# Altium schematic sheet Лист1.SchDoc: STM32_shield
size 594 x 420 mm; Author: Тихонов; DrawnBy: Тихонов
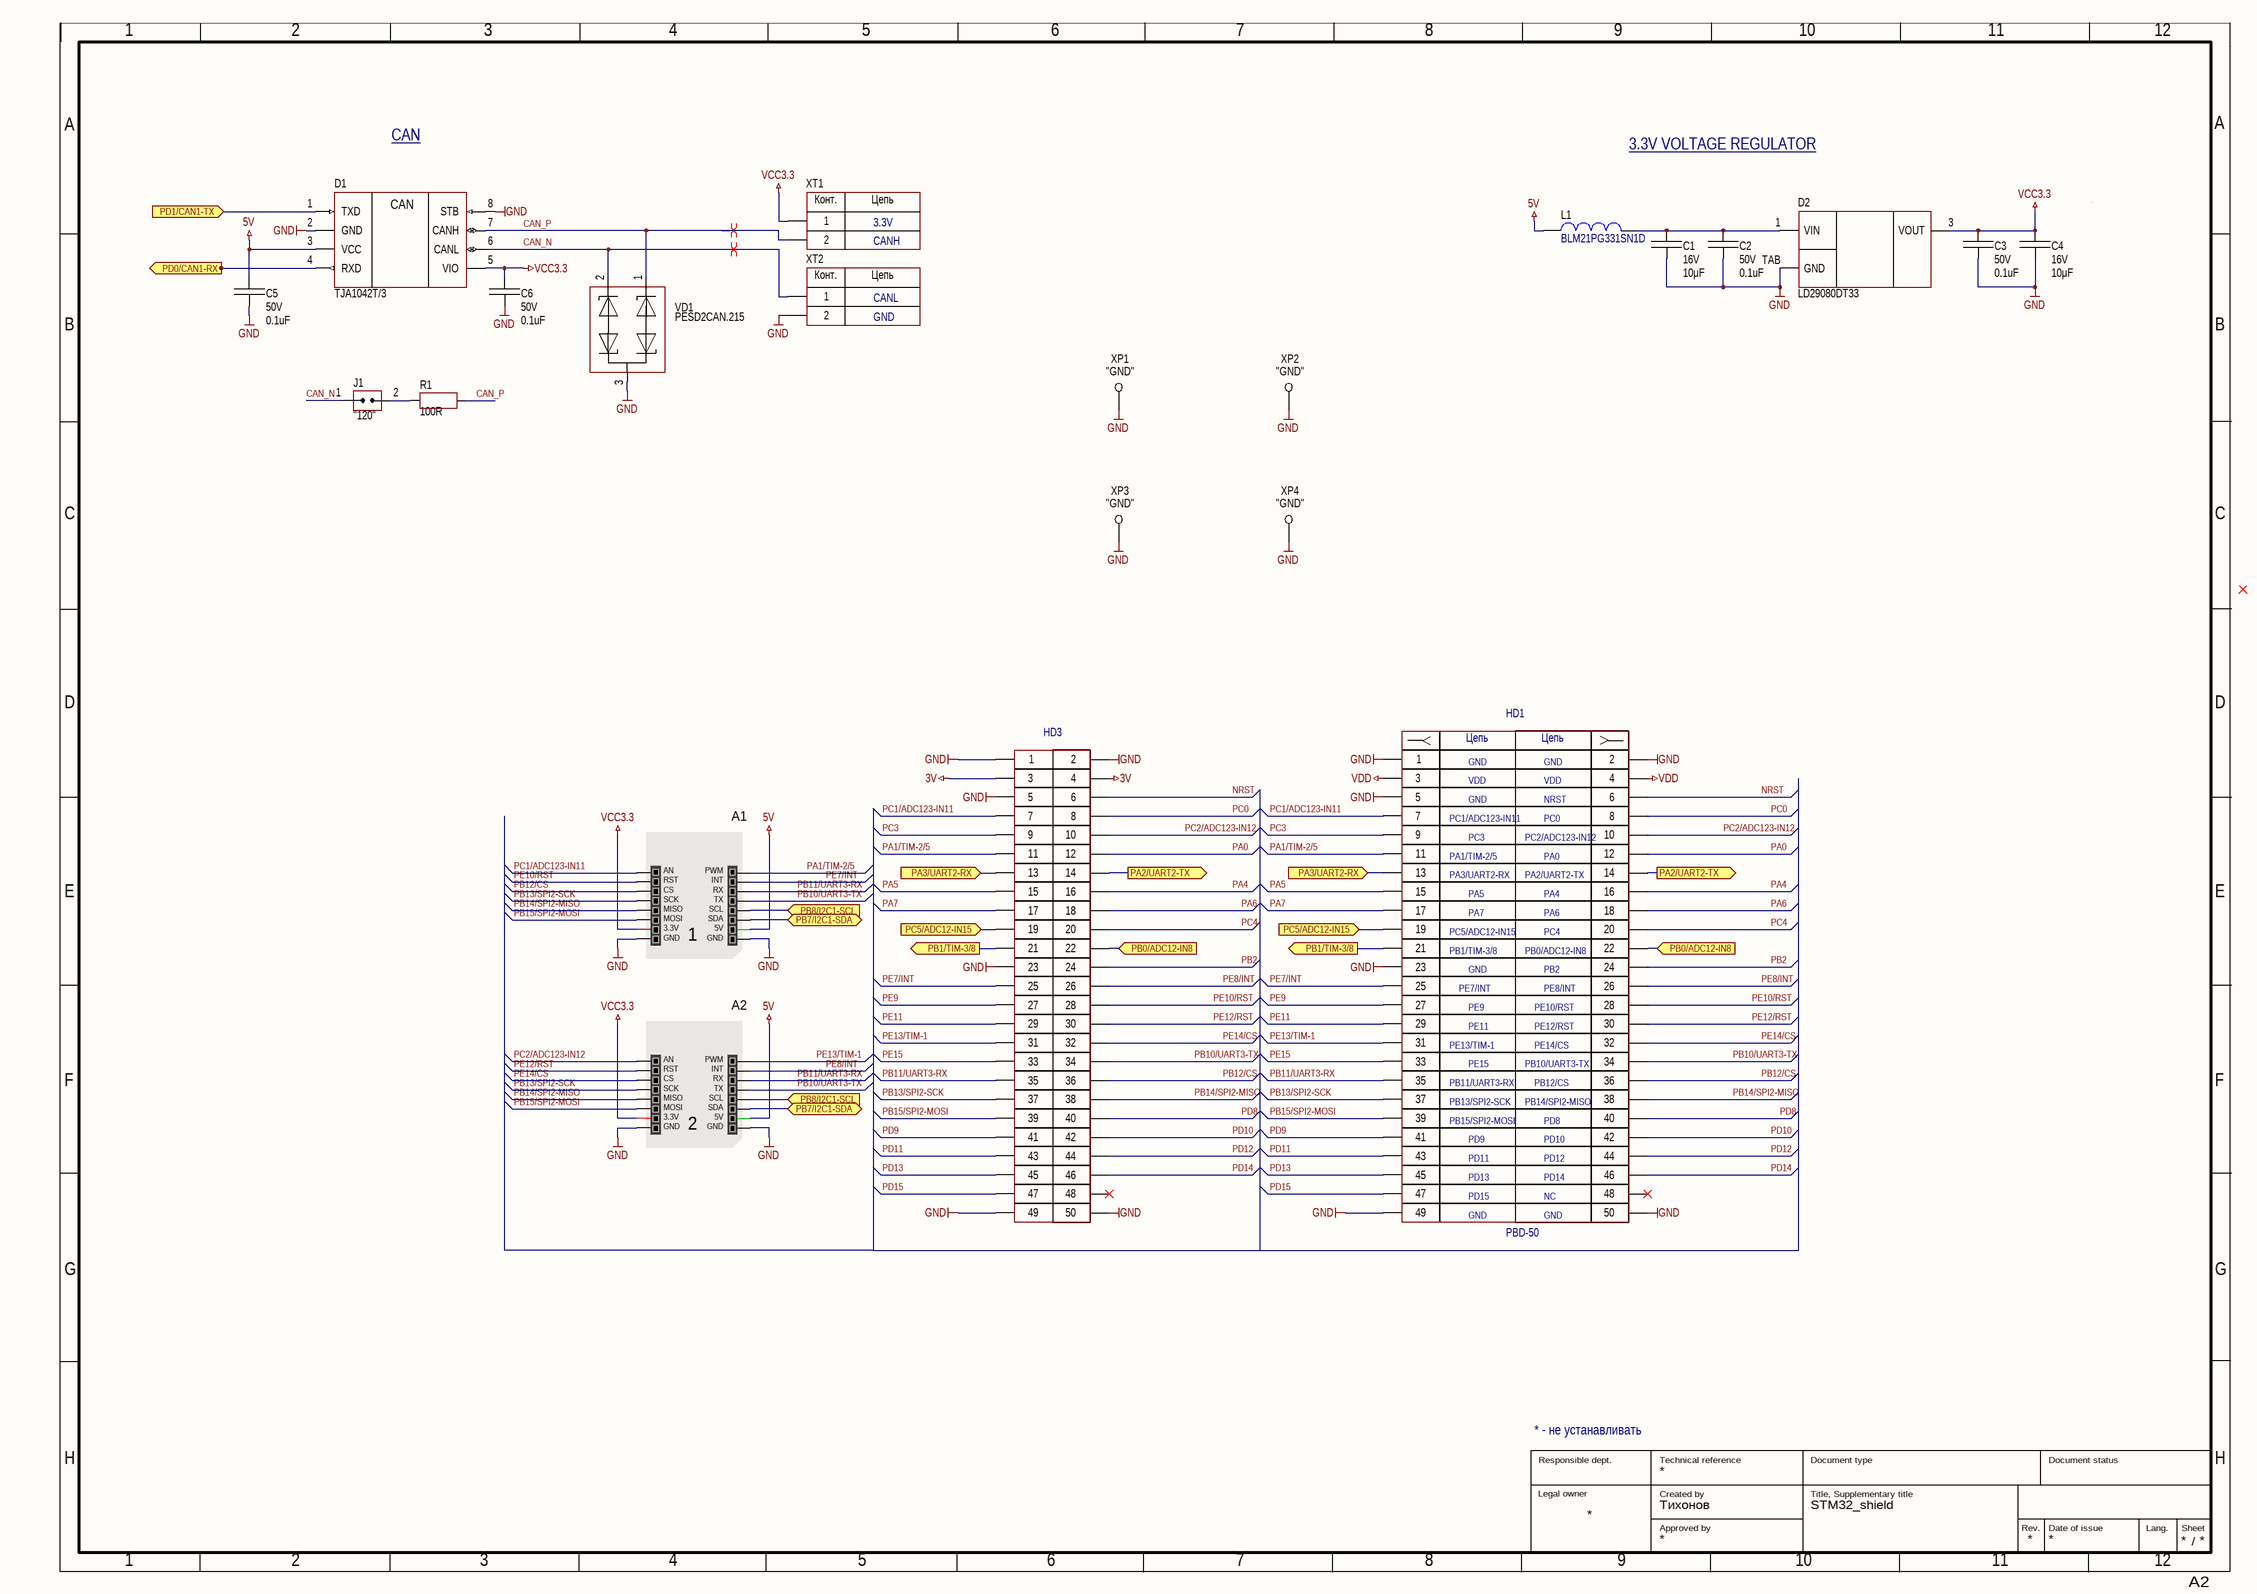
[diagram p0: Лист1.SchDoc]

## Parts
A1  MIKROBUS HOST CONN._1  [MIKROBUS HOST CONN.]  (value not drawn)
A2  MIKROBUS HOST CONN._1  [MIKROBUS HOST CONN.]  (value not drawn)
C1  value 10μF  Voltage: 16V  [CAP: TANTAL-A]
C2  value 0.1uF  Voltage: 50V  [CAP: 0603]
C3  value 0.1uF  Voltage: 50V  [CAP: 0603]
C4  value 10μF  Voltage: 16V  [CAP: TANTAL-A]
C5  value 0.1uF  Voltage: 50V  [CAP: 0603]
C6  value 0.1uF  Voltage: 50V  [CAP: 0603]
D1  (no value)  [8-SOIC]
D2  PartNumber: LD29080DT33  [DPAK(LDO)]
HD1  PBD-50  [CON: PBD-50]
HD3  PBD-50-1  [CON: PBD-50_NOT3D]  (value not drawn)
J1  CommentText: "120"  [CON: PLS-2]  (hidden comment: PLS-2)
L1  BLM21PG331SN1D  [IND: 0805]
R1  value 100R  [RES: 0603]
VD1  PartNumber: PESD2CAN.215  [SOT23]
XP1  "GND"  [CON: PLS-1]
XP2  "GND"  [CON: PLS-1]
XP3  "GND"  [CON: PLS-1]
XP4  "GND"  [CON: PLS-1]
XT1  (no value)  [CON: MPT 0,5/ 2-2,54 (Phoenix)]
XT2  (no value)  [CON: MPT 0,5/ 2-2,54 (Phoenix)]

## Ports
PA2/UART2-TX (out), PA3/UART2-RX (in), PB0/ADC12-IN8 (in), PB1/TIM-3/8 (out), PB7/I2C1-SDA (bidir), PB8/I2C1-SCL (in), PC5/ADC12-IN15 (in), PD0/CAN1-RX (out), PD1/CAN1-TX (in)

## Nets
3V: HD3.3 HD3.4
5V: A1.10(5V) A2.10(5V) C5.2 D1.3(VCC) L1.2
GND: A1.8(GND) A1.9(GND) A2.8(GND) A2.9(GND) C1.1 C2.1 C3.1 C4.1 C5.1 C6.1 D1.2(GND) D1.8(STB) D2.TAB(GND) HD1.1 HD1.2 HD1.5 HD1.23 HD1.49 HD1.50 HD3.1 HD3.2 HD3.5 HD3.23 HD3.49 HD3.50 VD1.3 XP1.1 XP2.1 XP3.1 XP4.1 XT2.2
VCC3.3: A1.7(3.3V) A2.7(3.3V) C3.2 C4.2 C6.2 D1.5(VIO) D2.3(VOUT) XT1.1
VDD: HD1.3 HD1.4
CAN_N: D1.6(CANL) J1.1(IN) VD1.2 XT2.1
CAN_P: D1.7(CANH) R1.2 VD1.1 XT1.2
NRST: HD1.6 HD3.6
PA0: HD1.12 HD3.12
PA1/TIM-2/5: A1.16(PWM) HD1.11 HD3.11
PA2/UART2-TX: HD1.14 HD3.14 ; port PA2/UART2-TX
PA3/UART2-RX: HD1.13 HD3.13 ; port PA3/UART2-RX
PA4: HD1.16 HD3.16
PA5: HD1.15 HD3.15
PA6: HD1.18 HD3.18
PA7: HD1.17 HD3.17
PB0/ADC12-IN8: HD1.22 HD3.22 ; port PB0/ADC12-IN8
PB1/TIM-3/8: HD1.21 HD3.21 ; port PB1/TIM-3/8
PB2: HD1.24 HD3.24
PB7/I2C1-SDA: A1.11(SDA) A2.11(SDA) ; port PB7/I2C1-SDA
PB8/I2C1-SCL: A1.12(SCL) A2.12(SCL) ; port PB8/I2C1-SCL
PB10/UART3-TX: A1.13(TX) A2.13(TX) HD1.34 HD3.34
PB11/UART3-RX: A1.14(RX) A2.14(RX) HD1.35 HD3.35
PB12/CS: A1.3(CS) HD1.36 HD3.36
PB13/SPI2-SCK: A1.4(SCK) A2.4(SCK) HD1.37 HD3.37
PB14/SPI2-MISO: A1.5(MISO) A2.5(MISO) HD1.38 HD3.38
PB15/SPI2-MOSI: A1.6(MOSI) A2.6(MOSI) HD1.39 HD3.39
PC0: HD1.8 HD3.8
PC1/ADC123-IN11: A1.1(AN) HD1.7 HD3.7
PC2/ADC123-IN12: A2.1(AN) HD1.10 HD3.10
PC3: HD1.9 HD3.9
PC4: HD1.20 HD3.20
PC5/ADC12-IN15: HD1.19 HD3.19 ; port PC5/ADC12-IN15
PD0/CAN1-RX: D1.4(RXD) ; port PD0/CAN1-RX
PD1/CAN1-TX: D1.1(TXD) ; port PD1/CAN1-TX
PD8: HD1.40 HD3.40
PD9: HD1.41 HD3.41
PD10: HD1.42 HD3.42
PD11: HD1.43 HD3.43
PD12: HD1.44 HD3.44
PD13: HD1.45 HD3.45
PD14: HD1.46 HD3.46
PD15: HD1.47 HD3.47
PE7/INT: A1.15(INT) HD1.25 HD3.25
PE8/INT: A2.15(INT) HD1.26 HD3.26
PE9: HD1.27 HD3.27
PE10/RST: A1.2(RST) HD1.28 HD3.28
PE11: HD1.29 HD3.29
PE12/RST: A2.2(RST) HD1.30 HD3.30
PE13/TIM-1: A2.16(PWM) HD1.31 HD3.31
PE14/CS: A2.3(CS) HD1.32 HD3.32
PE15: HD1.33 HD3.33
NetC1_2: C1.2 C2.2 D2.1(VIN) L1.1
NetJ1_2: J1.2(IN) R1.1

Not connected (* = marked no-connect by the designer): HD1 48*; HD3 48*

## Layout directives
differential pair: CAN_N, CAN_P

## Notes on the sheet
- CAN
- 3.3V VOLTAGE REGULATOR
- 3.3V
- CANH
- CANL
- GND
- (near HD1) GND
- (near HD1) VDD
- (near HD1) PC1/ADC123-IN11
- (near HD1) PC3
- (near HD1) PC2/ADC123-IN12
- (near HD1) NRST
- (near HD1) PC0
- (near HD1) PA1/TIM-2/5
- (near HD1) PA3/UART2-RX
- (near HD1) PA2/UART2-TX
- (near HD1) PA0
- (near HD1) PC5/ADC12-IN15
- (near HD1) PA5
- (near HD1) PA7
- (near HD1) PA4
- (near HD1) PA6
- (near HD1) PC4
- (near A1) 1
- (near HD1) PB1/TIM-3/8
- (near HD1) PB0/ADC12-IN8
- (near HD1) PB2
- (near HD1) PE7/INT
- (near HD1) PE9
- (near HD1) PE11
- (near HD1) PE10/RST
- (near HD1) PE12/RST
- (near HD1) PE8/INT
- (near HD1) PE13/TIM-1
- (near HD1) PE15
- (near HD1) PB10/UART3-TX
- (near HD1) PE14/CS
- (near HD1) PB11/UART3-RX
- (near HD1) PB13/SPI2-SCK
- (near HD1) PB15/SPI2-MOSI
- (near HD1) PB14/SPI2-MISO
- (near HD1) PB12/CS
- (near HD1) PD8
- (near A2) 2
- (near HD1) PD9
- (near HD1) PD11
- (near HD1) PD10
- (near HD1) PD12
- (near HD1) PD13
- (near HD1) PD15
- (near HD1) PD14
- (near HD1) NC
- * - не устанавливать
- 3
- 4
- 5
- 6
- 7
- 8
- 9
- 10
- 11
- 12
- A
- B
- C
- D
- E
- F
- G
- H
- Responsible dept.
- Technical reference
- Document type
- Document status
- Legal owner
- Created by
- Title, Supplementary title
- Approved by
- Rev.
- Date of issue
- Lang.
- Sheet
- /
- A2
- (in symbol Connector_terminal_2pin) Конт.; Цепь
- (in symbol PBD-50) Цепь

## Library data of the parts
A1 = MIKROBUS HOST CONN._1: mikroBUS Host Socket; PartNumber: PBS-8 (2pcs); Manufacturer: Connfly; Number: 1; SMD: No; HelpURL: https://www.electronshik.ru/item/CONNFLY/PBS-8
A2 = MIKROBUS HOST CONN._1: mikroBUS Host Socket; PartNumber: PBS-8 (2pcs); Manufacturer: Connfly; Number: 2; SMD: No; HelpURL: https://www.electronshik.ru/item/CONNFLY/PBS-8
C1 C4 = Tantal_B: Manufacturer: AVX; PartNumber: TAJB106K016RNJ; ValueManufacturerPartNumber: Tantalum capacitor, 10μF, 16V, ±10%, 1.2Ohm, case B (3528), -55...+125°C; Impedance: 1.2Ohm; Tolerance: ±10%; TypeDielectric: X7R; TypeCapacitor: Tantalum capacitor; Package: case B (3528); HelpURL: https://www.electronshik.ru/item/AVX/TAJB106K016RNJ; Temperature: -55...+125°C
C2 C3 C5 C6 = Ceramic_0603: Manufacturer: SAMSUNG; PartNumber: CL10B104KB8NNNC; ValueManufacturerPartNumber: Ceramic capacitor, 0.1uF, X7R, ±10%, 50V, 0603, -55...+125°C; TypeCapacitor: Ceramic capacitor; Tolerance: ±10%; TypeDielectric: X7R; Package: 0603; HelpURL: https://www.electronshik.ru/item/SAMSUNG/CL10B104KB8NNNC; Temperature: -55...+125°C
D1 = TJA1042T/3: CAN; Manufacturer: NXP; Supply: 5V; DataRate: 5Mbps; HelpURL: https://www.electronshik.ru/item/NXP/TJA1042T%3A%3A3.118; Package: SO8; ComponentType: IC CAN transceiver; ValueManufacturerPartNumber: =ComponentType+', '+DataRate+', '+TypeDuplex+', '+Supply+', '+Temperature+', '+Package; Temperature: -40...+85°C; PartNumber: TJA1042T/3
D2 = LD29080DT33R: Linear voltage regulator; Manufacturer: STMicroelectronics; ValueManufacturerPartNumber: Linear voltage regulator, input 4.3...8.8V, 0.4V, output 3.3V, 0.8A, -40...+85°C, DPAK(TO-252); VoltageInput: input 4.3...8.8V; MaxDropout: 0.4V; CurrentOutput: 0.8A; VoltageOutput: output 3.3V; HelpURL: https://www.electronshik.ru/item/ST/LD29080DT33R; Package: DPAK(TO-252); ComponentType: Linear voltage regulator; Temperature: -40...+85°C
HD1 = PBD-50: Розетка в 2 ряда; Manufacturer: Connfly Electronic; Part_Number: PBD-50 (DS1023-2x25); Value: *; Tolerance: *; RefDes/Designator: *; Pattern/Footprint: PBD-50; Publisher: TEN; Published: 2019; Type: Розетка; HelpURL: https://www.electronshik.ru/item/CONNFLY/PBD-50
HD3 = PBD-50-1: Пустое место; Manufacturer: Connfly Electronic; Part_Number: PBD-50; Value: *; Tolerance: *; RefDes/Designator: *; Pattern/Footprint: *; Publisher: TEN; Published: 2019; Type: Розетка; HelpURL: https://www.electronshik.ru/item/CONNFLY/PBD-50
J1 = Jumper_single: PartNumber: PLS-2
L1 = EMI_SMD: Manufacturer: Murata Electronics; TypeInductor: Fixed inductor; MaxCurrent: 1500mA; Value: 330Ohm@100Mhz; PartNumber: BLM21PG331SN1D; Package: 0805; HelpURL: https://www.electronshik.ru/item/MUR/BLM21PG331SN1D; ValueManufacturerPartNumber: =TypeInductor+', '+Value+', '+Tolerance+', '+Package+', '+MaxCurrent+', '+Temperature; Temperature: -55...+125°C
R1 = Resistor_0603: Manufacturer: Yageo; PartNumber: RC0603FR-07100RL; ValueManufacturerPartNumber: Resistor film, 100R, ±1%, 0603, 0.1W, -55...+125°C; TypeResistor: Resistor film; Power: 0.1W; Tolerance: ±1%; Package: 0603; HelpURL: https://www.electronshik.ru/item/YAG/RC0603FR-07100RL; Temperature: -55...+125°C
VD1 = PESD2CAN: Manufacturer: NEXPERIA; TypeDiode: ESD Suppressors; Breakdown Voltage: 28V; Package: SOT-23-3; HelpURL: https://www.electronshik.ru/item/NEX-NXP/PESD2CAN.215; ValueManufacturerPartNumber: =TypeDiode+', '+Voltage+', '+Current+', '+VoltageDrop+', '+RecoveryTime+', '+Package+', '+Temperature; Temperature: -65...+150°C
XP1-XP4 = PLS-1: Вилка; Manufacturer: Ningbo connfly electronic (Zhenqin); Part_Number: PLS-1; TU: *; Value: *; Tolerance: *; RefDes/Designator: *; Pattern/Footprint: *; Publisher: TEN; Published: 26.12.2017; Type: Control pin; HelpURL: \\Datasrv\дивизион эп\works\Департамент разработки\оСиСР\КОМПЛЕКТАЦИЯ\разъемы\pls.pdf
XT1 XT2 = Connector_terminal_2pin: Manufacturer: Китай; ValueManufacturerPartNumber: Клеммник винтовой, 2pin, 2.54m, 250В, 8A; PartNumber: 308-021-14; TypeConnector: Клеммник винтовой; VoltageMax: 250В; Pitch: 2.54m; CurrentMax: 8A; Multichannel: 2pin; CommentText: "Разъем"; HelpURL: https://www.chipdip.ru/product/dg350-3.5-02p-12; HelpURL2: https://www.electronshik.ru/item/DEGSON/DG308-2.54-02P-14-00A%5BH%5D